# Altium schematic sheet 05_Installation.SchDoc: FIXED-UPRIGHT INSTALLATION
size A4; Author: Henrique Rosa; DrawnBy: Henq / Codex; Engineer: Henrique Rosa; Address1: rua; Address: Bairro; Address3: São Paulo, SP - Brasil; Address4: 55 (11) 9 6825-6715; DocumentNumber: GBS-05; Revision: A; SheetNumber: 06; SheetTotal: 06; Site: henq.com; VersionControl_RevNumber: 03; PageSetup: Record=PageOptions|CenterHorizontal=True|CenterVertical=True|PrintScale=0.98|XCorrection=1.00|YCorrection=1.00|PrintKind=0|BorderSize=5000000|LeftOffset=0|BottomOffset=0|Orientation=2|PaperLength=1000|PaperWidth=1000|Scale=100|PaperSource=7|PrintQuality=-3|MediaType=1|DitherType=10|PrintScaleMode=1|PaperKind=A4|PaperIndex=9
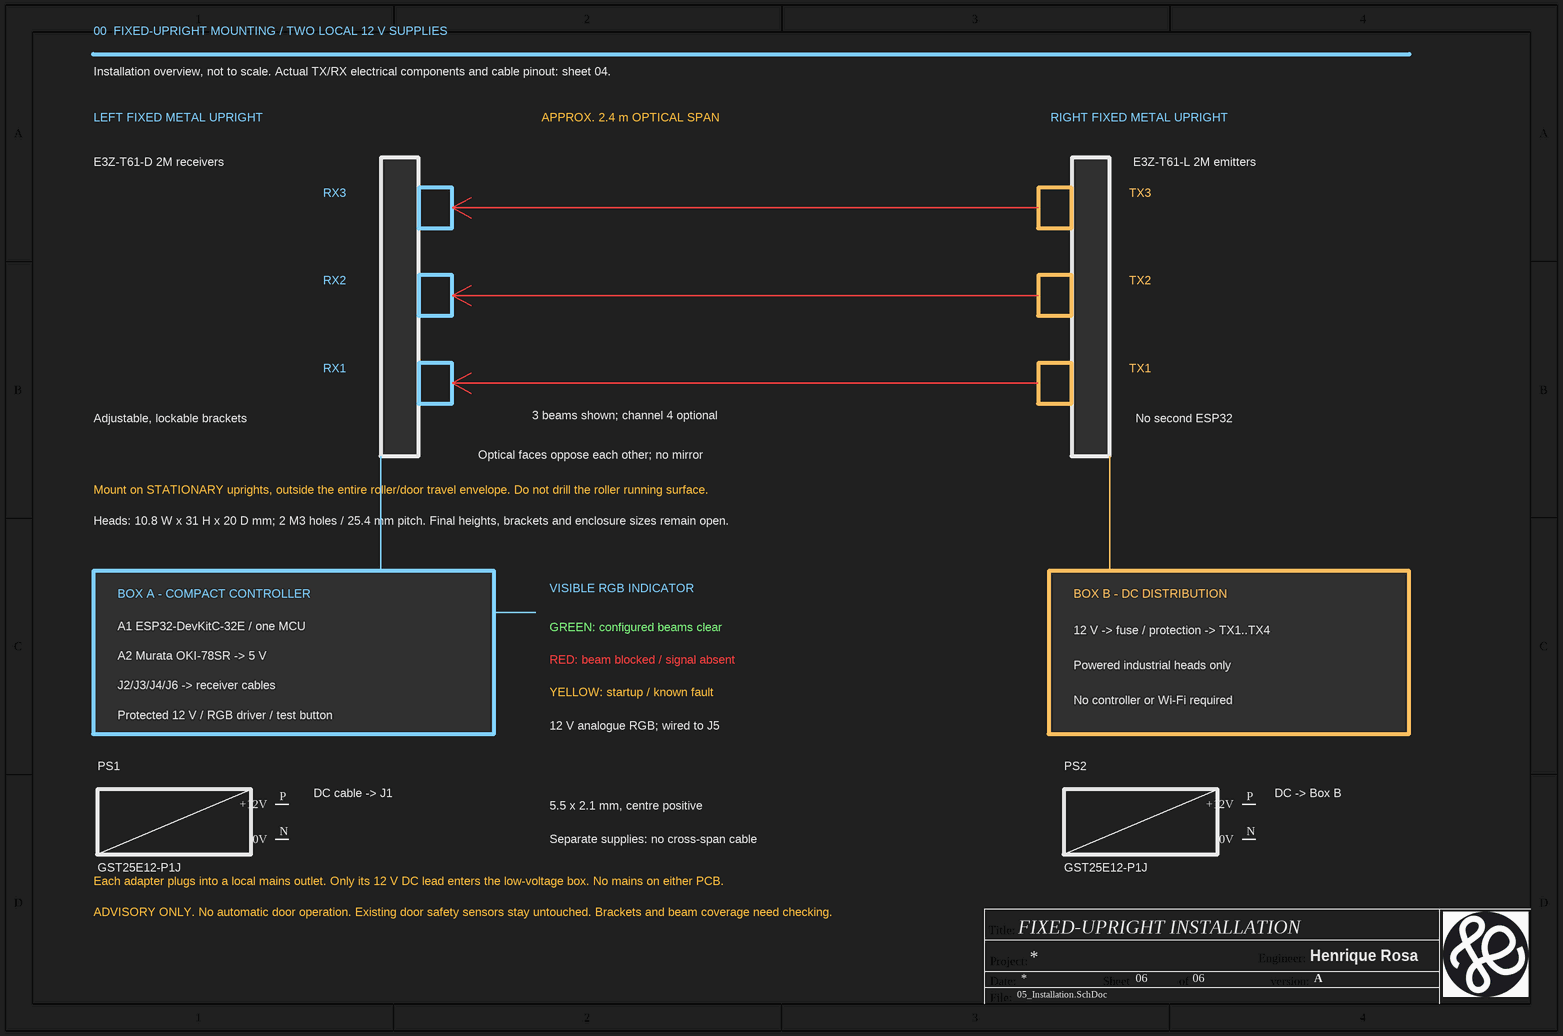
[diagram p0: 05_Installation.SchDoc]

## Parts
PS1  GST25E12-P1J  (graphical)
PS2  GST25E12-P1J  (graphical)

## Nets

Not connected (* = marked no-connect by the designer): PS1 N(0V) P(+12V); PS2 N(0V) P(+12V)

## Notes on the sheet
- 00  FIXED-UPRIGHT MOUNTING / TWO LOCAL 12 V SUPPLIES
- Installation overview, not to scale. Actual TX/RX electrical components and cable pinout: sheet 04.
- LEFT FIXED METAL UPRIGHT
- E3Z-T61-D 2M receivers
- APPROX. 2.4 m OPTICAL SPAN
- RIGHT FIXED METAL UPRIGHT
- E3Z-T61-L 2M emitters
- RX3
- TX3
- RX2
- TX2
- RX1
- TX1
- Adjustable, lockable brackets
- 3 beams shown; channel 4 optional
- No second ESP32
- Mount on STATIONARY uprights, outside the entire roller/door travel envelope. Do not drill the roller running surface.
- Optical faces oppose each other; no mirror
- Heads: 10.8 W x 31 H x 20 D mm; 2 M3 holes / 25.4 mm pitch. Final heights, brackets and enclosure sizes remain open.
- BOX A - COMPACT CONTROLLER
- A1 ESP32-DevKitC-32E / one MCU
- VISIBLE RGB INDICATOR
- GREEN: configured beams clear
- BOX B - DC DISTRIBUTION
- 12 V -> fuse / protection -> TX1..TX4
- A2 Murata OKI-78SR -> 5 V
- J2/J3/J4/J6 -> receiver cables
- Protected 12 V / RGB driver / test button
- RED: beam blocked / signal absent
- YELLOW: startup / known fault
- Powered industrial heads only
- No controller or Wi-Fi required
- 12 V analogue RGB; wired to J5
- (near PS1) DC cable -> J1
- 5.5 x 2.1 mm, centre positive
- Separate supplies: no cross-span cable
- (near PS2) DC -> Box B
- (near PS1) Each adapter plugs into a local mains outlet. Only its 12 V DC lead enters the low-voltage box. No mains on either PCB.
- ADVISORY ONLY. No automatic door operation. Existing door safety sensors stay untouched. Brackets and beam coverage need checking.
- Title:
- Project:
- Date:
- Sheet
- of
- Engineer:
- version:
- File:
- Title
- Size:
- A4
- Number:
- Time:
- Revision:

## Library data of the parts
PS1 PS2 = *: Intact certified AC/DC adapter, 12 V 2.08 A; Manufacturer: MEAN WELL; Populate: Yes; Intended footprint: NONE - external plug-in adapter; CAD status: Native external-equipment component with DC pins; no invented PCB footprint or 3D body; DC connector: 5.5 x 2.1 mm centre positive; keep adapter intact; Assembly location: External installation; not mounted on controller PCB; Procurement list: docs/PIN_REPAIR.html - external hardware; Manufacturer Part Number: GST25E12-P1J; Package: EXTERNAL EQUIPMENT; Datasheet: https://www.meanwell.com/Upload/PDF/GST25E/GST25E-SPEC.PDF